# Altium schematic sheet Power_Supply.SchDoc
size A3
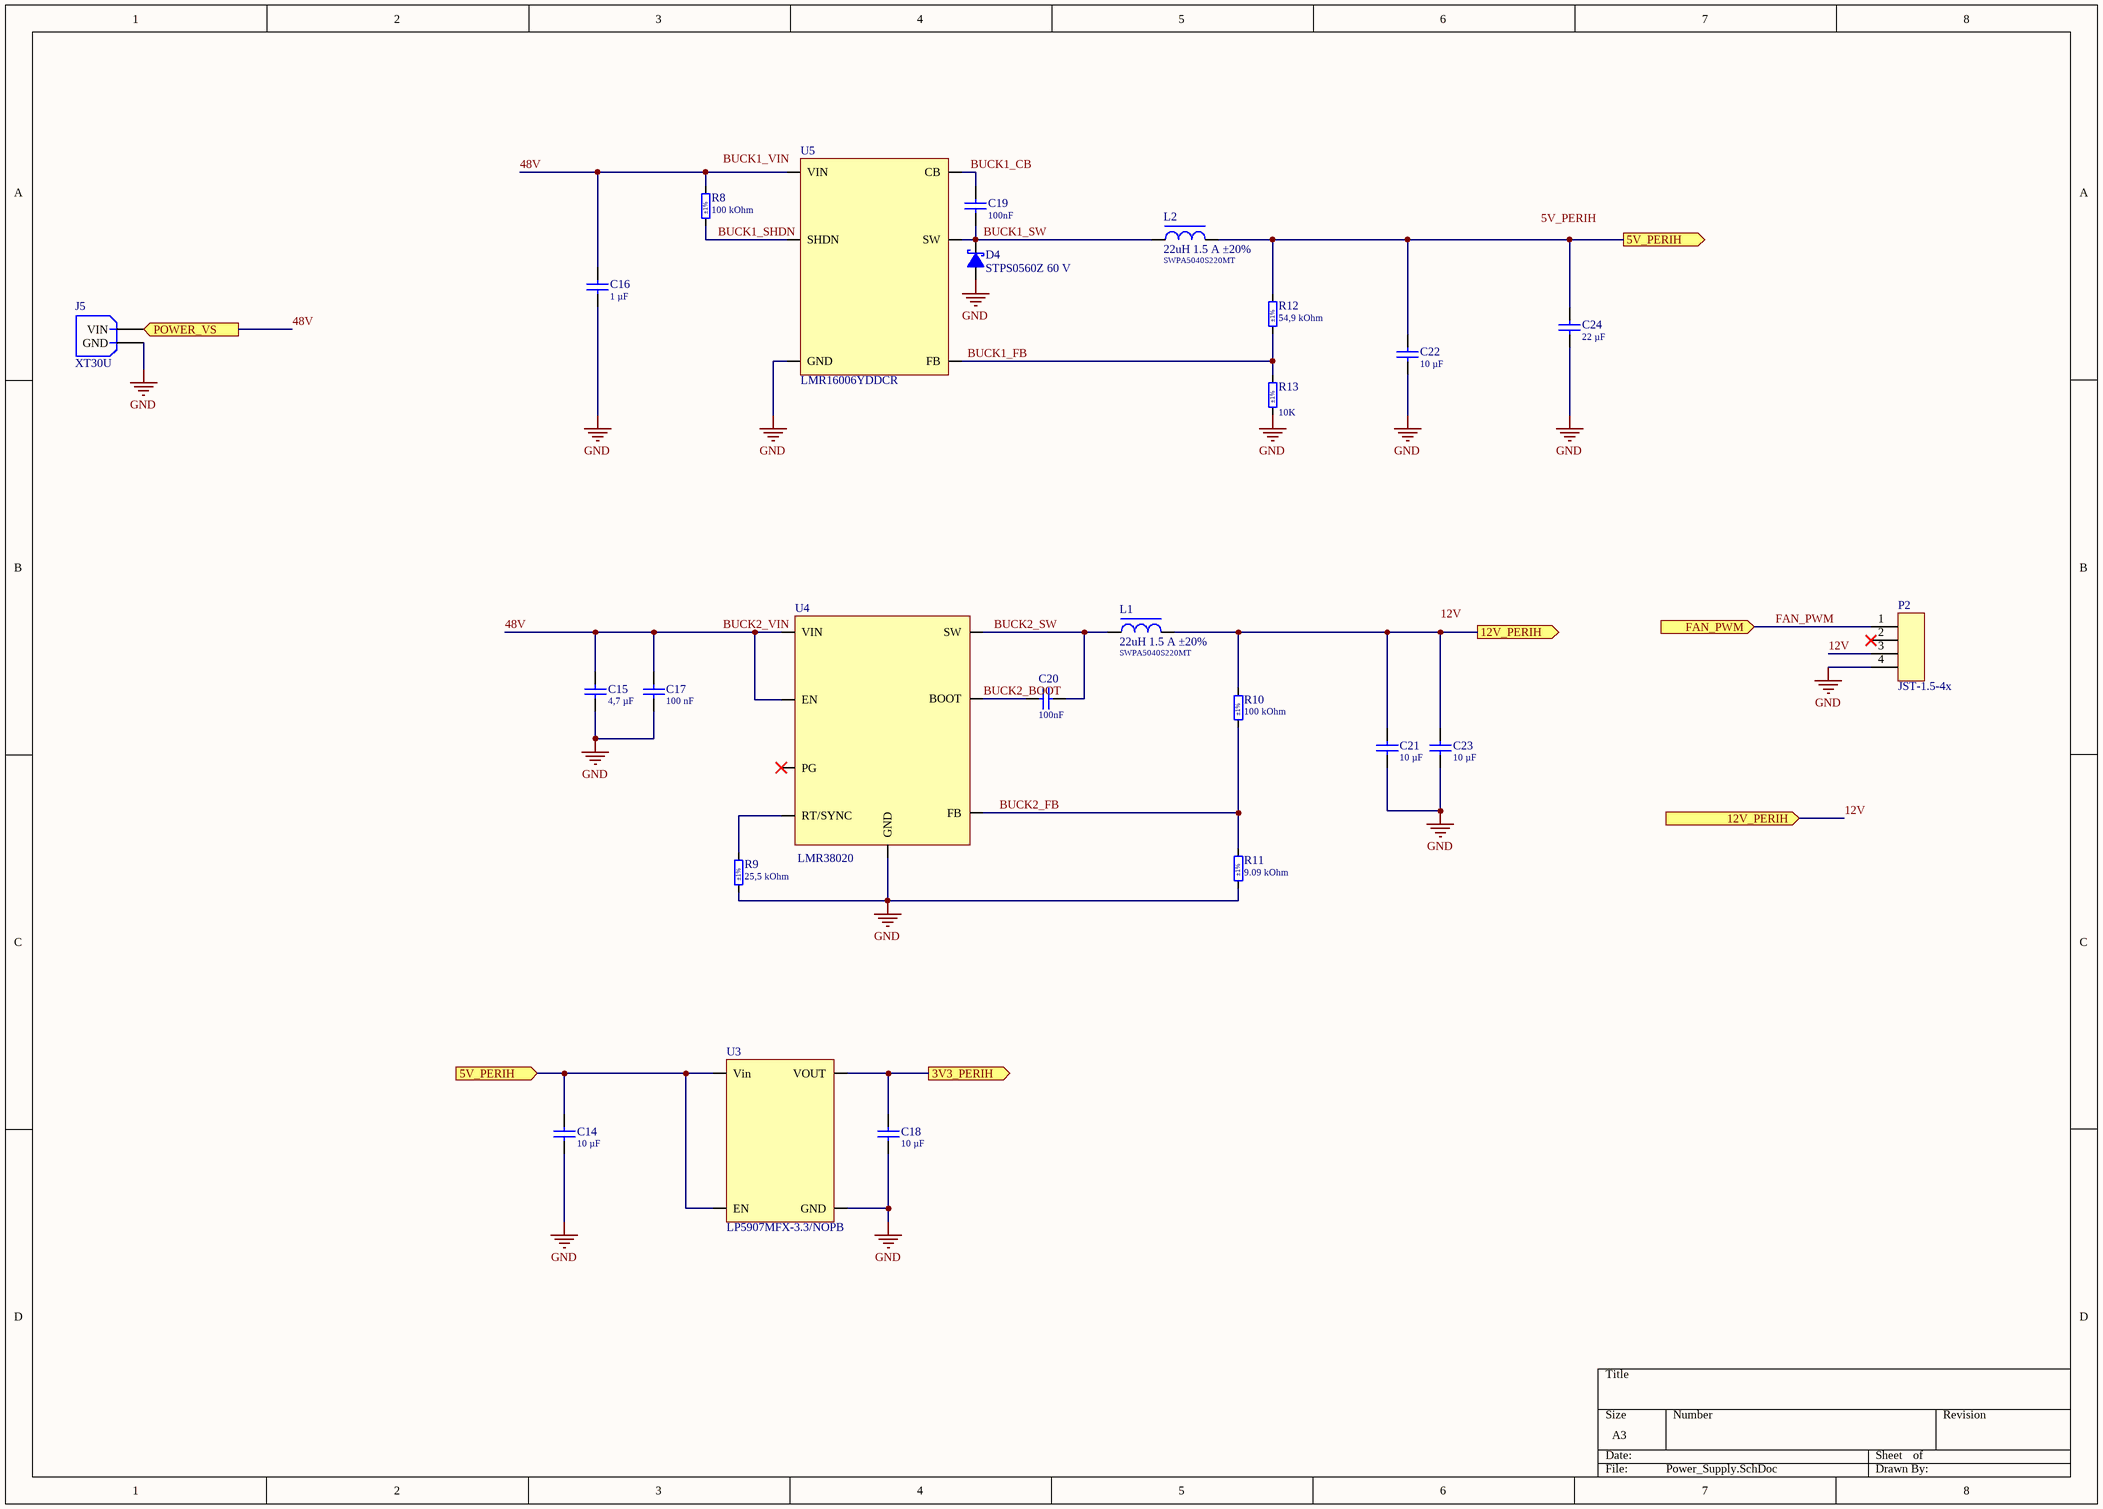
[diagram p0: Power_Supply.SchDoc]

## Parts
C14  Capacitance: 10 µF  [0805]  (hidden comment: 10 µF 16V X5R ±10% 0805)
C15  Capacitance: 4,7 µF  [1206]  (hidden comment: 4,7 µF 100V X5R ±10% 1206)
C16  Capacitance: 1 µF  [0805]  (hidden comment: 1 µF 100V X5R ±10% 0805)
C17  Capacitance: 100 nF  [1206]  (hidden comment: 100 nF 100V X5R ±10% 1206)
C18  Capacitance: 10 µF  [0805]  (hidden comment: 10 µF 16V X5R ±10% 0805)
C19  Capacitance: 100nF  [0402]  (hidden comment: 100nF 16V X7R ±10% 0402)
C20  Capacitance: 100nF  [0402]  (hidden comment: 100nF 16V X7R ±10% 0402)
C21  Capacitance: 10 µF  [0805]  (hidden comment: 10 µF 16V X5R ±10% 0805)
C22  Capacitance: 10 µF  [0805]  (hidden comment: 10 µF 16V X5R ±10% 0805)
C23  Capacitance: 10 µF  [0805]  (hidden comment: 10 µF 16V X5R ±10% 0805)
C24  Capacitance: 22 µF  [0603]  (hidden comment: 22 µF 10V X5R ±10% 0603)
D4  STPS0560Z 60 V  [SOD-123FL]
J5  XT30U  [XT30U-M]
L1  22uH 1.5 A ±20%  Name: SWPA5040S220MT  [SRN5040]
L2  22uH 1.5 A ±20%  Name: SWPA5040S220MT  [SRN5040]
P2  JST-1.5-4x  [JST- 4X - 1.5]
R8  Resistance: 100 kOhm  [0402]  (hidden comment: 100 kOhm 1/8 W 0402)
R9  Resistance: 25,5 kOhm  [0402]  (hidden comment: 25,5 kOhm 1/16 W 0402)
R10  Resistance: 100 kOhm  [0402]  (hidden comment: 100 kOhm 1/8 W 0402)
R11  Resistance: 9.09 kOhm  [0402]  (hidden comment: 9.09 kOhm 1/16 W 0402)
R12  Resistance: 54,9 kOhm  [0402]  (hidden comment: 54,9 kOhm 1/16 W 0402)
R13  Resistance: 10K  [0402]  (hidden comment: 10K 1/5W 0402)
U3  LP5907MFX-3.3/NOPB  [SOT23-5]
U4  LMR38020  [SOIC-8_TP]
U5  LMR16006YDDCR  [SOT-23-6]

## Ports
3V3_PERIH (out), 5V_PERIH (in), 5V_PERIH (out), 12V_PERIH (in), 12V_PERIH (out), FAN_PWM (in), POWER_VS (out)

## Nets
GND: C14.2 C15.2 C16.2 C17.2 C18.2 C21.2 C22.2 C23.2 C24.2 D4.2 J5.2(GND) P2.4 R9.1 R11.1 R13.1 U3.2(GND) U4.1(GND) U5.2(GND)
3V3_PERIH: C18.1 U3.5(VOUT) ; port 3V3_PERIH
5V_PERIH: C14.1 C22.1 C24.1 L2.2 R12.2 U3.1(Vin) U3.3(EN) ; port 5V_PERIH
12V: C21.1 C23.1 L1.2 P2.3 R10.2 ; port 12V_PERIH
48V: C15.1 C16.1 C17.1 J5.1(VIN) R8.2 U4.2(EN) U4.3(VIN) U5.5(VIN) ; port POWER_VS  [also labelled BUCK2_VIN]
BUCK1_CB: C19.2 U5.1(CB)
BUCK1_FB: R12.1 R13.2 U5.3(FB)
BUCK1_SHDN: R8.1 U5.4(SHDN)
BUCK1_SW: C19.1 D4.1 L2.1 U5.6(SW)
BUCK2_BOOT: C20.2 U4.7(BOOT)
BUCK2_FB: R10.1 R11.2 U4.5(FB)
BUCK2_SW: C20.1 L1.1 U4.8(SW)
FAN_PWM: P2.1 ; port FAN_PWM
NetR9_2: R9.2 U4.4(RT/SYNC)

Not connected (* = marked no-connect by the designer): P2 2*; U4 6(PG)*

## Notes on the sheet
- Labels drawn without touching a wire or pin: 5V_PERIH, 12V, BUCK1_VIN

## Library data of the parts
C14 C18 C21-C23 = Capacitor ceramic: Ceramic capacitor; Manufacturer: MURATA; HQ Part: CA0134789; Name: GRM21BR61C106KE15L; Voltage: 16V; Tolerance: ±10%; Dielectric: X5R; BOMString: =Capacitance+' '+Voltage+' '+Tolerance+' '+Footprint; HelpURL: *; Supplier: *
C15 = Capacitor ceramic: Ceramic capacitor; Manufacturer: Taiyo Yuden; Name: HMK325BJ475KN-TE; Voltage: 100V; Tolerance: ±10%; Dielectric: X5R; BOMString: =Capacitance+' '+Voltage+' '+Tolerance+' '+Footprint; HelpURL: *; Supplier: *
C16 = Capacitor ceramic: Ceramic capacitor; Manufacturer: Yageo; Name: CC0805KKX7R0BB105; Voltage: 100V; Tolerance: ±10%; Dielectric: X5R; BOMString: =Capacitance+' '+Voltage+' '+Tolerance+' '+Footprint; HelpURL: *; Supplier: *
C17 = Capacitor ceramic: Ceramic capacitor; Manufacturer: MURATA; Name: GRM155R62A104KE14D; Voltage: 100V; Tolerance: ±10%; Dielectric: X5R; BOMString: =Capacitance+' '+Voltage+' '+Tolerance+' '+Footprint; HelpURL: *; Supplier: *
C19 C20 = Capacitor ceramic: Ceramic capacitor; Manufacturer: Yageo; Name: CC0402KRX7R7BB104; Voltage: 16V; Tolerance: ±10%; Dielectric: X7R; BOMString: =Capacitance+' '+Voltage+' '+Tolerance+' '+Footprint; HelpURL: *; Supplier: *
C24 = Capacitor ceramic: Ceramic capacitor; Manufacturer: Yageo; Name: CC0603MRX5R6BB226; Voltage: 10V; Tolerance: ±10%; Dielectric: X5R; BOMString: =Capacitance+' '+Voltage+' '+Tolerance+' '+Footprint; HelpURL: *; Supplier: *
D4 = SchottkyDiode: Schottky Diode; Manufacturer: ST; HQ Part: DS0002882; Voltage: 60 V; Device: diode; Supplier: supplier; Price(1): 0; Price(100): 0; Name: STPS0560Z; BOMString: =Name+' '+Current+' '+Voltage+' 'Footprint
L1 L2 = Inductance cored: Inductor with iron core; Manufacturer: Sunlord; HQ Part: IN0024300; Current: 1.5 A; Resistance: 168mΩ; Inductance: 22uH; Tolerance: ±20%; BOMString: =Inductance+' '+Tolerance+' '+Footprint; HelpURL: *; Supplier: *
R8 = Resistor: Thik Film Chip Resistor; Manufacturer: Yageo; Power: 1/8 W; Tolerance: ±1%; Name: RC0402FR-7W100KL; Supplier: *; HelpURL: *; BOMString: =Resistance+' '+Tolerance+' '+Power+' '+Footprint
R9 = Resistor: Thik Film Chip Resistor; Manufacturer: Yageo; Power: 1/16 W; Tolerance: ±1%; Name: RC0402FR-0725K5L; Supplier: *; HelpURL: *; BOMString: =Resistance+' '+Tolerance+' '+Power+' '+Footprint
R10 = Resistor: Thik Film Chip Resistor; Manufacturer: Yageo; HQ Part: RE0186870; Power: 1/8 W; Tolerance: ±1%; Name: RC0402FR-7W100KL; Supplier: *; HelpURL: *; BOMString: =Resistance+' '+Tolerance+' '+Power+' '+Footprint
R11 = Resistor: Thik Film Chip Resistor; Manufacturer: Ralec; Power: 1/16 W; Tolerance: ±1%; Name: RTT029091FTH; Supplier: *; HelpURL: *; BOMString: =Resistance+' '+Tolerance+' '+Power+' '+Footprint
R12 = Resistor: Thik Film Chip Resistor; Manufacturer: Yageo; HQ Part: RE0186870; Power: 1/16 W; Tolerance: ±1%; Name: RC0402FR-0754K9L; Supplier: *; HelpURL: *; BOMString: =Resistance+' '+Tolerance+' '+Power+' '+Footprint
R13 = Resistor: Thin Film Chip Resistor; Manufacturer: YAGEO; Tolerance: ±1%; Name: SR0402FR-7T10KL; Power: 1/5W; Supplier: *; HelpURL: *; BOMString: =Resistance+' '+Tolerance+' '+Power+' '+Footprint
U3 = LP5907MFX-3.3/NOPB: "Low-dropout regulator"
U4 = LMR38020: Name: *; Manufacturer: *; BOMString: *; Value: *; Parameter 5: *; Parameter 6: *